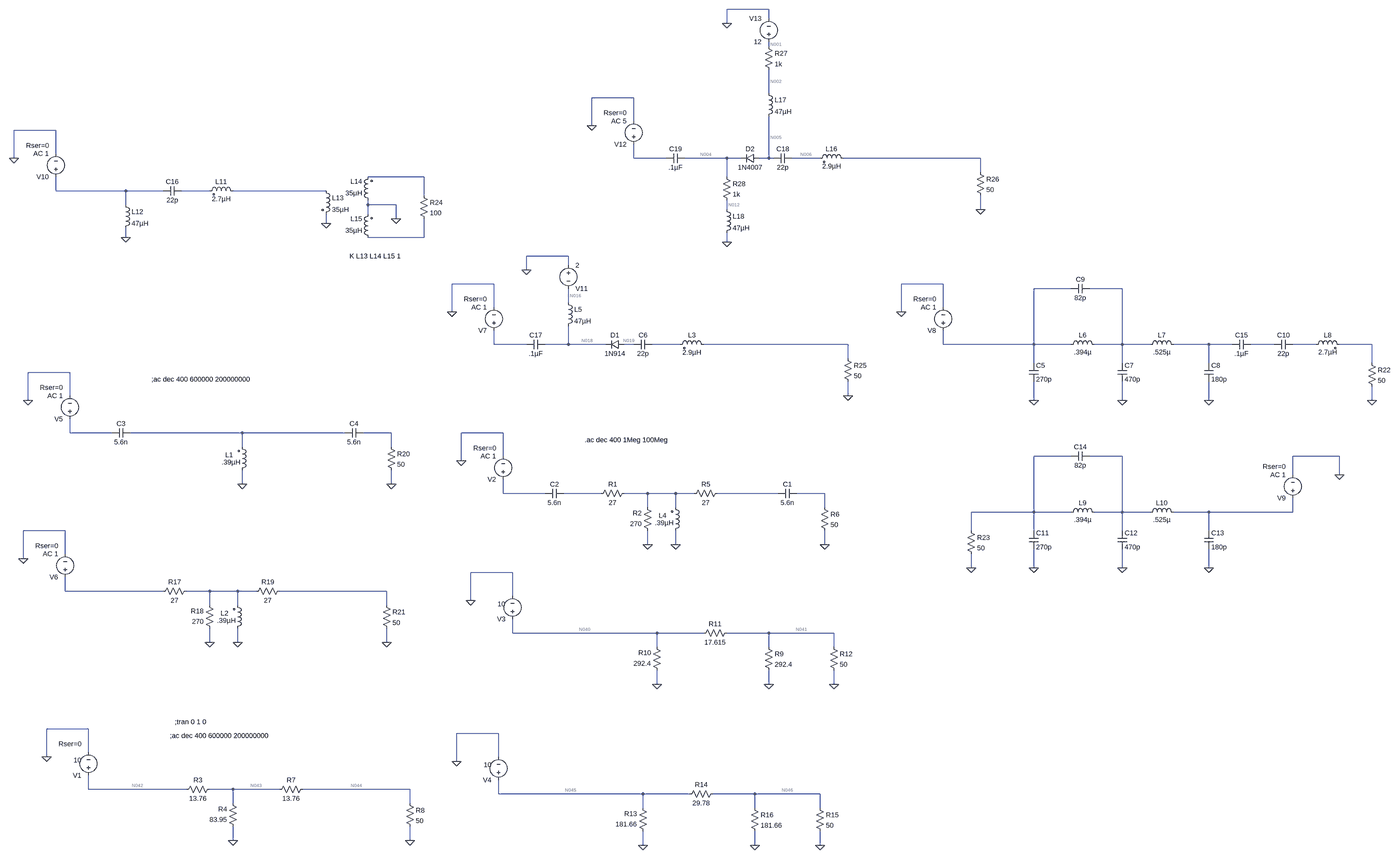
[diagram p0: schematic magnis preamp.asc, whole sheet]
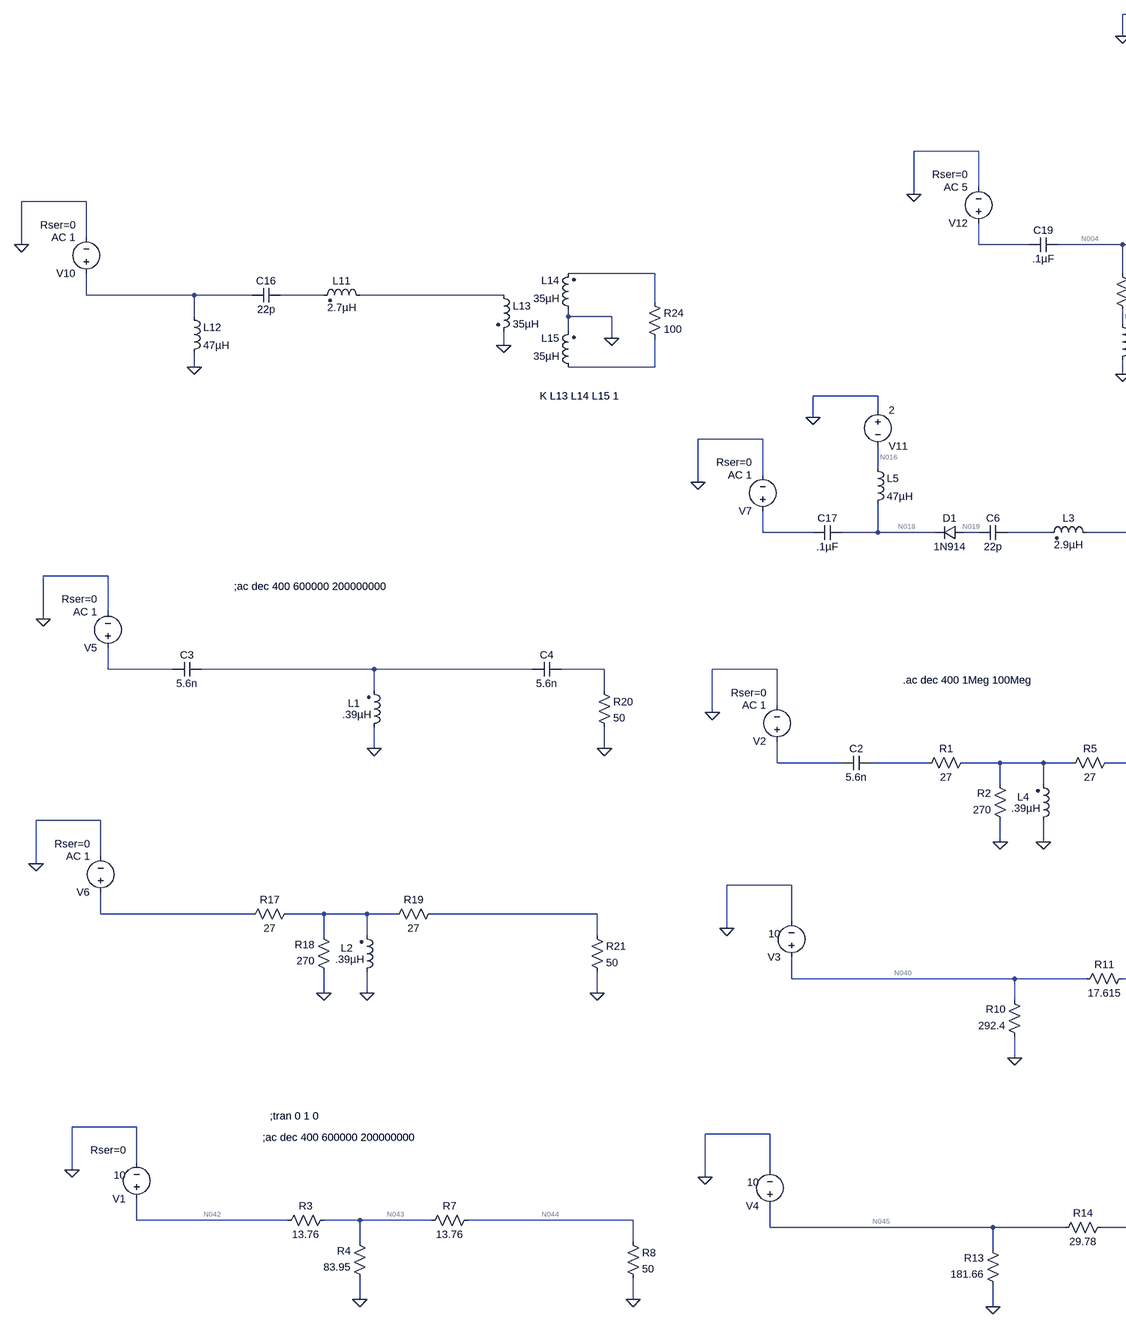
[diagram p1: schematic magnis preamp.asc, part, row 1 of 1, column 1 of 2]
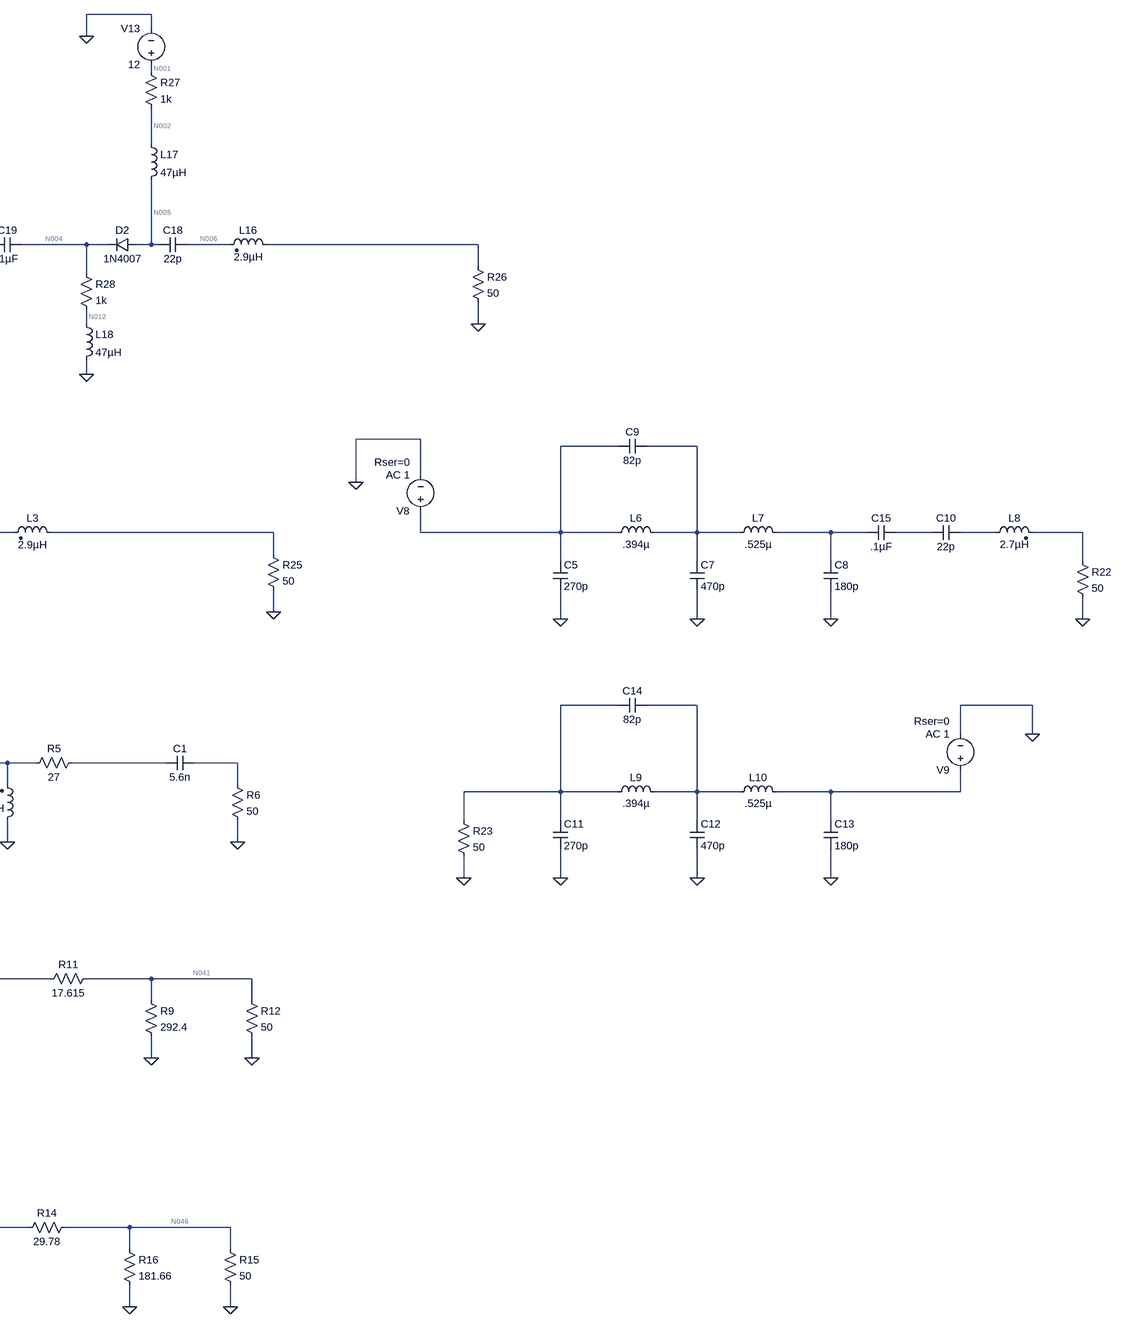
[diagram p2: schematic magnis preamp.asc, part, row 1 of 1, column 2 of 2]
magnis preamp.asc, the LTspice schematic file:
Version 4
SHEET 1 4788 768
WIRE 2144 -2624 2000 -2624
WIRE 2144 -2592 2144 -2624
WIRE 2000 -2576 2000 -2624
WIRE 2144 -2496 2144 -2512
WIRE 2144 -2336 2144 -2416
WIRE 1680 -2320 1536 -2320
WIRE 1680 -2240 1680 -2320
WIRE 1536 -2224 1536 -2320
WIRE -304 -2208 -448 -2208
WIRE -304 -2128 -304 -2208
WIRE -448 -2112 -448 -2208
WIRE 1680 -2112 1680 -2160
WIRE 1792 -2112 1680 -2112
WIRE 2000 -2112 1856 -2112
WIRE 2048 -2112 2000 -2112
WIRE 2144 -2112 2144 -2256
WIRE 2144 -2112 2112 -2112
WIRE 2160 -2112 2144 -2112
WIRE 2320 -2112 2224 -2112
WIRE 2896 -2112 2400 -2112
WIRE 2896 -2064 2896 -2112
WIRE 960 -2048 768 -2048
WIRE 2000 -2048 2000 -2112
WIRE -304 -2000 -304 -2048
WIRE -64 -2000 -304 -2000
WIRE 64 -2000 -64 -2000
WIRE 224 -2000 128 -2000
WIRE 624 -2000 304 -2000
WIRE 960 -1984 960 -2048
WIRE -64 -1952 -64 -2000
WIRE 768 -1952 768 -1968
WIRE 864 -1952 768 -1952
WIRE 2000 -1936 2000 -1968
WIRE 2896 -1936 2896 -1984
WIRE 768 -1920 768 -1952
WIRE 864 -1904 864 -1952
WIRE 624 -1888 624 -1920
WIRE -64 -1840 -64 -1872
WIRE 960 -1840 960 -1904
WIRE 960 -1840 768 -1840
WIRE 2000 -1824 2000 -1856
WIRE 1456 -1776 1312 -1776
WIRE 1456 -1744 1456 -1776
WIRE 1312 -1728 1312 -1776
WIRE 1200 -1680 1056 -1680
WIRE 2768 -1680 2624 -1680
WIRE 3232 -1664 3104 -1664
WIRE 3408 -1664 3296 -1664
WIRE 1456 -1616 1456 -1664
WIRE 1200 -1600 1200 -1680
WIRE 2768 -1600 2768 -1680
WIRE 1056 -1584 1056 -1680
WIRE 2624 -1584 2624 -1680
WIRE 1200 -1472 1200 -1520
WIRE 1312 -1472 1200 -1472
WIRE 1456 -1472 1456 -1536
WIRE 1456 -1472 1376 -1472
WIRE 1584 -1472 1456 -1472
WIRE 1680 -1472 1648 -1472
WIRE 1840 -1472 1744 -1472
WIRE 2416 -1472 1920 -1472
WIRE 2768 -1472 2768 -1520
WIRE 3104 -1472 3104 -1664
WIRE 3104 -1472 2768 -1472
WIRE 3232 -1472 3104 -1472
WIRE 3408 -1472 3408 -1664
WIRE 3408 -1472 3312 -1472
WIRE 3504 -1472 3408 -1472
WIRE 3712 -1472 3584 -1472
WIRE 3792 -1472 3712 -1472
WIRE 3936 -1472 3856 -1472
WIRE 4080 -1472 4000 -1472
WIRE 4272 -1472 4160 -1472
WIRE 2416 -1424 2416 -1472
WIRE 3104 -1408 3104 -1472
WIRE 3408 -1408 3408 -1472
WIRE 3712 -1408 3712 -1472
WIRE 4272 -1408 4272 -1472
WIRE -256 -1376 -400 -1376
WIRE -256 -1296 -256 -1376
WIRE 2416 -1296 2416 -1344
WIRE -400 -1280 -400 -1376
WIRE 3104 -1280 3104 -1344
WIRE 3408 -1280 3408 -1344
WIRE 3712 -1280 3712 -1344
WIRE 4272 -1280 4272 -1328
WIRE -256 -1168 -256 -1216
WIRE -112 -1168 -256 -1168
WIRE 336 -1168 -48 -1168
WIRE 688 -1168 336 -1168
WIRE 848 -1168 752 -1168
WIRE 1232 -1168 1088 -1168
WIRE 336 -1120 336 -1168
WIRE 848 -1120 848 -1168
WIRE 1232 -1088 1232 -1168
WIRE 3232 -1088 3104 -1088
WIRE 3408 -1088 3296 -1088
WIRE 4160 -1088 4000 -1088
WIRE 1088 -1072 1088 -1168
WIRE 4000 -1024 4000 -1088
WIRE 4160 -1024 4160 -1088
WIRE 336 -992 336 -1040
WIRE 848 -992 848 -1040
WIRE 1232 -960 1232 -1008
WIRE 1376 -960 1232 -960
WIRE 1568 -960 1440 -960
WIRE 1728 -960 1648 -960
WIRE 1824 -960 1728 -960
WIRE 1888 -960 1824 -960
WIRE 2176 -960 1968 -960
WIRE 2336 -960 2240 -960
WIRE 1728 -912 1728 -960
WIRE 1824 -912 1824 -960
WIRE 2336 -912 2336 -960
WIRE 3104 -896 3104 -1088
WIRE 3104 -896 2864 -896
WIRE 3232 -896 3104 -896
WIRE 3408 -896 3408 -1088
WIRE 3408 -896 3312 -896
WIRE 3504 -896 3408 -896
WIRE 3712 -896 3584 -896
WIRE 4000 -896 4000 -944
WIRE 4000 -896 3712 -896
WIRE -272 -832 -416 -832
WIRE 2864 -832 2864 -896
WIRE 3104 -832 3104 -896
WIRE 3408 -832 3408 -896
WIRE 3712 -832 3712 -896
WIRE 1728 -784 1728 -832
WIRE 1824 -784 1824 -832
WIRE 2336 -784 2336 -832
WIRE -272 -752 -272 -832
WIRE -416 -736 -416 -832
WIRE 2864 -704 2864 -752
WIRE 3104 -704 3104 -768
WIRE 3408 -704 3408 -768
WIRE 3712 -704 3712 -768
WIRE 1264 -688 1120 -688
WIRE -272 -624 -272 -672
WIRE 64 -624 -272 -624
WIRE 224 -624 144 -624
WIRE 320 -624 224 -624
WIRE 384 -624 320 -624
WIRE 832 -624 464 -624
WIRE 1264 -608 1264 -688
WIRE 1120 -592 1120 -688
WIRE 224 -576 224 -624
WIRE 320 -576 320 -624
WIRE 832 -576 832 -624
WIRE 1264 -480 1264 -528
WIRE 1760 -480 1264 -480
WIRE 1920 -480 1760 -480
WIRE 2144 -480 2000 -480
WIRE 2368 -480 2144 -480
WIRE 224 -448 224 -496
WIRE 320 -448 320 -496
WIRE 832 -448 832 -496
WIRE 1760 -432 1760 -480
WIRE 2144 -432 2144 -480
WIRE 2368 -432 2368 -480
WIRE 1760 -304 1760 -352
WIRE 2144 -304 2144 -352
WIRE 2368 -304 2368 -352
WIRE -192 -96 -336 -96
WIRE 1216 -80 1072 -80
WIRE -192 -16 -192 -96
WIRE -336 0 -336 -96
WIRE 1216 0 1216 -80
WIRE 1072 16 1072 -80
WIRE -192 112 -192 64
WIRE 144 112 -192 112
WIRE 304 112 224 112
WIRE 464 112 304 112
WIRE 912 112 544 112
WIRE 1216 128 1216 80
WIRE 1712 128 1216 128
WIRE 1872 128 1712 128
WIRE 2096 128 1952 128
WIRE 2320 128 2096 128
WIRE 304 160 304 112
WIRE 912 160 912 112
WIRE 1712 176 1712 128
WIRE 2096 176 2096 128
WIRE 2320 176 2320 128
WIRE 304 288 304 240
WIRE 912 288 912 240
WIRE 1712 304 1712 256
WIRE 2096 304 2096 256
WIRE 2320 304 2320 256
FLAG 1088 -1072 0
FLAG 1728 -784 0
FLAG 1824 -784 0
FLAG 2336 -784 0
FLAG -336 0 0
FLAG 304 288 0
FLAG 912 288 0
FLAG 1120 -592 0
FLAG 1760 -304 0
FLAG 2368 -304 0
FLAG 2144 -304 0
FLAG 1072 16 0
FLAG 1712 304 0
FLAG 2320 304 0
FLAG 2096 304 0
FLAG -400 -1280 0
FLAG 336 -992 0
FLAG 848 -992 0
FLAG -416 -736 0
FLAG 224 -448 0
FLAG 320 -448 0
FLAG 832 -448 0
FLAG 1056 -1584 0
FLAG 2416 -1296 0
FLAG 2624 -1584 0
FLAG 4272 -1280 0
FLAG 3104 -1280 0
FLAG 3408 -1280 0
FLAG 3712 -1280 0
FLAG 3104 -704 0
FLAG 3408 -704 0
FLAG 3712 -704 0
FLAG 4160 -1024 0
FLAG 2864 -704 0
FLAG -448 -2112 0
FLAG -64 -1840 0
FLAG 864 -1904 0
FLAG 624 -1888 0
FLAG 1312 -1728 0
FLAG 1536 -2224 0
FLAG 2896 -1936 0
FLAG 2000 -2576 0
FLAG 2000 -1824 0
SYMBOL ind2 1808 -816 M180
WINDOW 0 -42 68 Left 2
WINDOW 3 -55 43 Left 2
SYMATTR InstName L4
SYMATTR Value .39µH
SYMATTR Type ind
SYMBOL voltage 1232 -992 R180
WINDOW 123 24 96 Left 2
WINDOW 39 24 124 Left 2
WINDOW 3 46 103 Left 2
SYMATTR Value2 AC 1
SYMATTR SpiceLine Rser=0
SYMATTR Value ""
SYMATTR InstName V2
SYMBOL cap 1440 -976 R90
WINDOW 0 0 32 VBottom 2
WINDOW 3 32 32 VTop 2
SYMATTR InstName C2
SYMATTR Value 5.6n
SYMBOL res 1664 -976 R90
WINDOW 0 0 56 VBottom 2
WINDOW 3 32 56 VTop 2
SYMATTR InstName R1
SYMATTR Value 27
SYMBOL res 1744 -816 R180
WINDOW 0 36 76 Left 2
WINDOW 3 36 40 Left 2
SYMATTR InstName R2
SYMATTR Value 270
SYMBOL res 1872 -944 R270
WINDOW 0 32 56 VTop 2
WINDOW 3 0 56 VBottom 2
SYMATTR InstName R5
SYMATTR Value 27
SYMBOL res 2320 -928 R0
SYMATTR InstName R6
SYMATTR Value 50
SYMBOL cap 2240 -976 R90
WINDOW 0 0 32 VBottom 2
WINDOW 3 32 32 VTop 2
SYMATTR InstName C1
SYMATTR Value 5.6n
SYMBOL voltage -192 80 R180
WINDOW 123 24 96 Left 2
WINDOW 39 24 124 Left 2
WINDOW 3 24 68 Left 2
SYMATTR SpiceLine Rser=0
SYMATTR Value 10
SYMATTR InstName V1
SYMBOL res 240 96 R90
WINDOW 0 0 56 VBottom 2
WINDOW 3 32 56 VTop 2
SYMATTR InstName R3
SYMATTR Value 13.76
SYMBOL res 320 256 R180
WINDOW 0 36 76 Left 2
WINDOW 3 36 40 Left 2
SYMATTR InstName R4
SYMATTR Value 83.95
SYMBOL res 448 128 R270
WINDOW 0 32 56 VTop 2
WINDOW 3 0 56 VBottom 2
SYMATTR InstName R7
SYMATTR Value 13.76
SYMBOL res 896 144 R0
SYMATTR InstName R8
SYMATTR Value 50
SYMBOL voltage 1264 -512 R180
WINDOW 123 24 96 Left 2
WINDOW 39 24 124 Left 2
WINDOW 3 24 68 Left 2
SYMATTR Value 10
SYMATTR InstName V3
SYMBOL res 1776 -336 R180
WINDOW 0 36 76 Left 2
WINDOW 3 36 40 Left 2
SYMATTR InstName R10
SYMATTR Value 292.4
SYMBOL res 1904 -464 R270
WINDOW 0 32 56 VTop 2
WINDOW 3 0 56 VBottom 2
SYMATTR InstName R11
SYMATTR Value 17.615
SYMBOL res 2352 -448 R0
SYMATTR InstName R12
SYMATTR Value 50
SYMBOL res 2128 -448 R0
SYMATTR InstName R9
SYMATTR Value 292.4
SYMBOL voltage 1216 96 R180
WINDOW 123 24 96 Left 2
WINDOW 39 24 124 Left 2
WINDOW 3 24 68 Left 2
SYMATTR Value 10
SYMATTR InstName V4
SYMBOL res 1728 272 R180
WINDOW 0 36 76 Left 2
WINDOW 3 36 40 Left 2
SYMATTR InstName R13
SYMATTR Value 181.66
SYMBOL res 1856 144 R270
WINDOW 0 32 56 VTop 2
WINDOW 3 0 56 VBottom 2
SYMATTR InstName R14
SYMATTR Value 29.78
SYMBOL res 2304 160 R0
SYMATTR InstName R15
SYMATTR Value 50
SYMBOL res 2080 160 R0
SYMATTR InstName R16
SYMATTR Value 181.66
SYMBOL ind2 320 -1024 M180
WINDOW 0 -42 68 Left 2
WINDOW 3 -55 43 Left 2
SYMATTR InstName L1
SYMATTR Value .39µH
SYMATTR Type ind
SYMBOL voltage -256 -1200 R180
WINDOW 123 24 96 Left 2
WINDOW 39 24 124 Left 2
WINDOW 3 46 103 Left 2
SYMATTR Value2 AC 1
SYMATTR SpiceLine Rser=0
SYMATTR Value ""
SYMATTR InstName V5
SYMBOL cap -48 -1184 R90
WINDOW 0 0 32 VBottom 2
WINDOW 3 32 32 VTop 2
SYMATTR InstName C3
SYMATTR Value 5.6n
SYMBOL res 832 -1136 R0
SYMATTR InstName R20
SYMATTR Value 50
SYMBOL cap 752 -1184 R90
WINDOW 0 0 32 VBottom 2
WINDOW 3 32 32 VTop 2
SYMATTR InstName C4
SYMATTR Value 5.6n
SYMBOL ind2 304 -480 M180
WINDOW 0 -42 68 Left 2
WINDOW 3 -55 43 Left 2
SYMATTR InstName L2
SYMATTR Value .39µH
SYMATTR Type ind
SYMBOL voltage -272 -656 R180
WINDOW 123 24 96 Left 2
WINDOW 39 24 124 Left 2
WINDOW 3 46 103 Left 2
SYMATTR Value2 AC 1
SYMATTR SpiceLine Rser=0
SYMATTR Value ""
SYMATTR InstName V6
SYMBOL res 160 -640 R90
WINDOW 0 0 56 VBottom 2
WINDOW 3 32 56 VTop 2
SYMATTR InstName R17
SYMATTR Value 27
SYMBOL res 240 -480 R180
WINDOW 0 36 76 Left 2
WINDOW 3 36 40 Left 2
SYMATTR InstName R18
SYMATTR Value 270
SYMBOL res 368 -608 R270
WINDOW 0 32 56 VTop 2
WINDOW 3 0 56 VBottom 2
SYMATTR InstName R19
SYMATTR Value 27
SYMBOL res 816 -592 R0
SYMATTR InstName R21
SYMATTR Value 50
SYMBOL ind2 1936 -1456 M270
WINDOW 0 32 56 VTop 2
WINDOW 3 4 56 VBottom 2
SYMATTR InstName L3
SYMATTR Value 2.9µH
SYMATTR Type ind
SYMBOL voltage 1200 -1504 R180
WINDOW 123 24 96 Left 2
WINDOW 39 24 124 Left 2
WINDOW 3 46 103 Left 2
SYMATTR Value2 AC 1
SYMATTR SpiceLine Rser=0
SYMATTR Value ""
SYMATTR InstName V7
SYMBOL res 2400 -1440 R0
SYMATTR InstName R25
SYMATTR Value 50
SYMBOL cap 1744 -1488 R90
WINDOW 0 0 32 VBottom 2
WINDOW 3 32 32 VTop 2
SYMATTR InstName C6
SYMATTR Value 22p
SYMBOL voltage 2768 -1504 R180
WINDOW 123 24 96 Left 2
WINDOW 39 24 124 Left 2
WINDOW 3 46 103 Left 2
SYMATTR Value2 AC 1
SYMATTR SpiceLine Rser=0
SYMATTR Value ""
SYMATTR InstName V8
SYMBOL res 4256 -1424 R0
SYMATTR InstName R22
SYMATTR Value 50
SYMBOL ind 3216 -1456 R270
WINDOW 0 32 56 VTop 2
WINDOW 3 5 56 VBottom 2
SYMATTR InstName L6
SYMATTR Value .394µ
SYMBOL ind 3488 -1456 R270
WINDOW 0 32 56 VTop 2
WINDOW 3 5 56 VBottom 2
SYMATTR InstName L7
SYMATTR Value .525µ
SYMBOL cap 3088 -1408 R0
SYMATTR InstName C5
SYMATTR Value 270p
SYMBOL cap 3392 -1408 R0
SYMATTR InstName C7
SYMATTR Value 470p
SYMBOL cap 3696 -1408 R0
SYMATTR InstName C8
SYMATTR Value 180p
SYMBOL cap 3296 -1680 R90
WINDOW 0 0 32 VBottom 2
WINDOW 3 32 32 VTop 2
SYMATTR InstName C9
SYMATTR Value 82p
SYMBOL cap 4000 -1488 R90
WINDOW 0 0 32 VBottom 2
WINDOW 3 32 32 VTop 2
SYMATTR InstName C10
SYMATTR Value 22p
SYMBOL ind2 4064 -1456 R270
WINDOW 0 32 56 VTop 2
WINDOW 3 5 56 VBottom 2
SYMATTR InstName L8
SYMATTR Value 2.7µH
SYMATTR Type ind
SYMBOL ind 3216 -880 R270
WINDOW 0 32 56 VTop 2
WINDOW 3 5 56 VBottom 2
SYMATTR InstName L9
SYMATTR Value .394µ
SYMBOL ind 3488 -880 R270
WINDOW 0 32 56 VTop 2
WINDOW 3 5 56 VBottom 2
SYMATTR InstName L10
SYMATTR Value .525µ
SYMBOL cap 3088 -832 R0
SYMATTR InstName C11
SYMATTR Value 270p
SYMBOL cap 3392 -832 R0
SYMATTR InstName C12
SYMATTR Value 470p
SYMBOL cap 3696 -832 R0
SYMATTR InstName C13
SYMATTR Value 180p
SYMBOL cap 3296 -1104 R90
WINDOW 0 0 32 VBottom 2
WINDOW 3 32 32 VTop 2
SYMATTR InstName C14
SYMATTR Value 82p
SYMBOL voltage 4000 -928 R180
WINDOW 123 24 96 Left 2
WINDOW 39 24 124 Left 2
WINDOW 3 46 103 Left 2
SYMATTR Value2 AC 1
SYMATTR SpiceLine Rser=0
SYMATTR Value ""
SYMATTR InstName V9
SYMBOL res 2848 -848 R0
SYMATTR InstName R23
SYMATTR Value 50
SYMBOL cap 3856 -1488 R90
WINDOW 0 0 32 VBottom 2
WINDOW 3 32 32 VTop 2
SYMATTR InstName C15
SYMATTR Value .1µF
SYMBOL ind2 320 -1984 M270
WINDOW 0 32 56 VTop 2
WINDOW 3 4 56 VBottom 2
SYMATTR InstName L11
SYMATTR Value 2.7µH
SYMATTR Type ind
SYMBOL voltage -304 -2032 R180
WINDOW 123 24 96 Left 2
WINDOW 39 24 124 Left 2
WINDOW 3 46 103 Left 2
SYMATTR Value2 AC 1
SYMATTR SpiceLine Rser=0
SYMATTR Value ""
SYMATTR InstName V10
SYMBOL cap 128 -2016 R90
WINDOW 0 0 32 VBottom 2
WINDOW 3 32 32 VTop 2
SYMATTR InstName C16
SYMATTR Value 22p
SYMBOL ind -80 -1968 R0
SYMATTR InstName L12
SYMATTR Value 47µH
SYMBOL ind2 608 -2016 R0
SYMATTR InstName L13
SYMATTR Value 35µH
SYMATTR Type ind
SYMBOL ind2 784 -1952 R180
WINDOW 0 36 80 Left 2
WINDOW 3 36 40 Left 2
SYMATTR InstName L14
SYMATTR Value 35µH
SYMATTR Type ind
SYMBOL ind2 784 -1824 R180
WINDOW 0 36 80 Left 2
WINDOW 3 36 40 Left 2
SYMATTR InstName L15
SYMATTR Value 35µH
SYMATTR Type ind
SYMBOL res 944 -2000 R0
SYMATTR InstName R24
SYMATTR Value 100
SYMBOL voltage 1456 -1760 R0
WINDOW 0 24 96 Left 2
WINDOW 3 24 16 Left 2
WINDOW 123 0 0 Left 0
WINDOW 39 0 0 Left 0
SYMATTR InstName V11
SYMATTR Value 2
SYMBOL cap 1376 -1488 R90
WINDOW 0 0 32 VBottom 2
WINDOW 3 32 32 VTop 2
SYMATTR InstName C17
SYMATTR Value .1µF
SYMBOL ind 1440 -1632 R0
SYMATTR InstName L5
SYMATTR Value 47µH
SYMBOL diode 1648 -1488 R90
WINDOW 0 0 32 VBottom 2
WINDOW 3 32 32 VTop 2
SYMATTR InstName D1
SYMATTR Value 1N914
SYMBOL ind2 2416 -2096 M270
WINDOW 0 32 56 VTop 2
WINDOW 3 4 56 VBottom 2
SYMATTR InstName L16
SYMATTR Value 2.9µH
SYMATTR Type ind
SYMBOL voltage 1680 -2144 R180
WINDOW 123 24 96 Left 2
WINDOW 39 24 124 Left 2
WINDOW 3 46 103 Left 2
SYMATTR Value2 AC 5
SYMATTR SpiceLine Rser=0
SYMATTR Value ""
SYMATTR InstName V12
SYMBOL res 2880 -2080 R0
SYMATTR InstName R26
SYMATTR Value 50
SYMBOL cap 2224 -2128 R90
WINDOW 0 0 32 VBottom 2
WINDOW 3 32 32 VTop 2
SYMATTR InstName C18
SYMATTR Value 22p
SYMBOL voltage 2144 -2496 R180
WINDOW 0 24 96 Left 2
WINDOW 3 24 16 Left 2
WINDOW 123 0 0 Left 0
WINDOW 39 0 0 Left 0
SYMATTR InstName V13
SYMATTR Value 12
SYMBOL cap 1856 -2128 R90
WINDOW 0 0 32 VBottom 2
WINDOW 3 32 32 VTop 2
SYMATTR InstName C19
SYMATTR Value .1µF
SYMBOL ind 2128 -2352 R0
SYMATTR InstName L17
SYMATTR Value 47µH
SYMBOL ind 1984 -1952 R0
SYMATTR InstName L18
SYMATTR Value 47µH
SYMBOL res 2128 -2512 R0
SYMATTR InstName R27
SYMATTR Value 1k
SYMBOL diode 2112 -2128 R90
WINDOW 0 0 32 VBottom 2
WINDOW 3 32 32 VTop 2
SYMATTR InstName D2
SYMATTR Value 1N4007
SYMBOL res 1984 -2064 R0
SYMATTR InstName R28
SYMATTR Value 1k
TEXT 1512 -1144 Left 2 !.ac dec 400 1Meg 100Meg
TEXT 88 -72 Left 2 !;ac dec 400 600000 200000000
TEXT 104 -120 Left 2 !;tran 0 1 0
TEXT 24 -1352 Left 2 !;ac dec 400 600000 200000000
TEXT 704 -1776 Left 2 !K L13 L14 L15 1

The netlist it stands for:
* magnis preamp.asc
L4 0 N033 .39µH
V2 N031 0 AC 1 Rser=0
C2 N032 N031 5.6n
R1 N033 N032 27
R2 0 N033 270
R5 N033 N034 27
R6 N035 0 50
C1 N035 N034 5.6n
V1 N042 0 10 Rser=0
R3 N043 N042 13.76
R4 0 N043 83.95
R7 N043 N044 13.76
R8 N044 0 50
V3 N040 0 10
R10 0 N040 292.4
R11 N040 N041 17.615
R12 N041 0 50
R9 N041 0 292.4
V4 N045 0 10
R13 0 N045 181.66
R14 N045 N046 29.78
R15 N046 0 50
R16 N046 0 181.66
L1 0 N027 .39µH
V5 N026 0 AC 1 Rser=0
C3 N027 N026 5.6n
R20 N028 0 50
C4 N028 N027 5.6n
L2 0 N038 .39µH
V6 N037 0 AC 1 Rser=0
R17 N038 N037 27
R18 0 N038 270
R19 N038 N039 27
R21 N039 0 50
L3 N021 N020 2.9µH
V7 N017 0 AC 1 Rser=0
R25 N021 0 50
C6 N020 N019 22p
V8 N014 0 AC 1 Rser=0
R22 N025 0 50
L6 N014 N015 .394µ
L7 N015 N022 .525µ
C5 N014 0 270p
C7 N015 0 470p
C8 N022 0 180p
C9 N015 N014 82p
C10 N024 N023 22p
L8 N024 N025 2.7µH
L9 N029 N030 .394µ
L10 N030 N036 .525µ
C11 N029 0 270p
C12 N030 0 470p
C13 N036 0 180p
C14 N030 N029 82p
V9 N036 0 AC 1 Rser=0
R23 N029 0 50
C15 N023 N022 .1µF
L11 N011 N010 2.7µH
V10 N009 0 AC 1 Rser=0
C16 N010 N009 22p
L12 N009 0 47µH
L13 N011 0 35µH
L14 0 N008 35µH
L15 N013 0 35µH
R24 N008 N013 100
V11 0 N016 2
C17 N018 N017 .1µF
L5 N016 N018 47µH
D1 N019 N018 1N914
L16 N007 N006 2.9µH
V12 N003 0 AC 5 Rser=0
R26 N007 0 50
C18 N006 N005 22p
V13 N001 0 12
C19 N004 N003 .1µF
L17 N002 N005 47µH
L18 N012 0 47µH
R27 N001 N002 1k
D2 N005 N004 1N4007
R28 N004 N012 1k
.model D D
.lib standard.dio
.ac dec 400 1Meg 100Meg
;ac dec 400 600000 200000000
;tran 0 1 0
;ac dec 400 600000 200000000
K L13 L14 L15 1
.backanno
.end

* Results of the author's LTspice run, read from the files saved beside the schematic
* Operating Point, zero values left out:
*   V(n042) = 10 V
*   V(n043) = 7.248 V
*   V(n044) = 5.684 V
*   V(n040) = 10 V
*   V(n041) = 7.079 V
*   V(n045) = 10 V
*   V(n046) = 5.683 V
*   V(n019) = -2 V
*   V(n016) = -2 V
*   V(n018) = -2 V
*   V(n005) = 6.318 V
*   V(n001) = 12 V
*   V(n004) = 5.682 V
*   V(n002) = 6.318 V
*   V(n012) = 5.682 µV
*   I(D2) = 5.682 mA
*   I(L18) = 5.682 mA
*   I(L17) = 5.682 mA
*   I(R28) = 5.682 mA
*   I(R27) = 5.682 mA
*   I(R16) = 31.29 mA
*   I(R15) = 113.7 mA
*   I(R14) = 145 mA
*   I(R13) = -55.05 mA
*   I(R9) = 24.21 mA
*   I(R12) = 141.6 mA
*   I(R11) = 165.8 mA
*   I(R10) = -34.2 mA
*   I(R8) = 113.7 mA
*   I(R7) = 113.7 mA
*   I(R4) = -86.34 mA
*   I(R3) = -200 mA
*   I(V13) = -5.682 mA
*   I(V4) = -200 mA
*   I(V3) = -200 mA
*   I(V1) = -200 mA
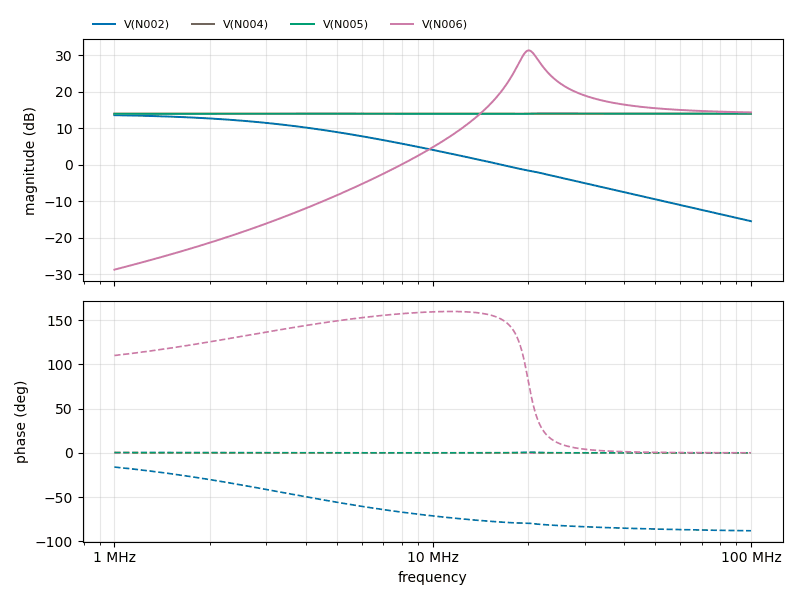
[diagram p3: AC Analysis of magnis preamp.asc, plotted from the saved traces]
* AC Analysis, 1 run:
*   V(N002): 13.58 dB at 1 MHz, -15.43 dB at 100 MHz, peak 13.58 dB at 1 MHz, 3 dB below the peak at 3.696 MHz
*   V(N004): 13.98 dB at 1 MHz, 13.98 dB at 100 MHz, peak 13.99 dB at 21.26 MHz
*   V(N005): 13.94 dB at 1 MHz, 13.98 dB at 100 MHz, peak 14.03 dB at 21.38 MHz
*   V(N006): -28.70 dB at 1 MHz, 14.33 dB at 100 MHz, peak 31.29 dB at 20.07 MHz, 3 dB below the peak at 18.78 MHz and 21.59 MHz